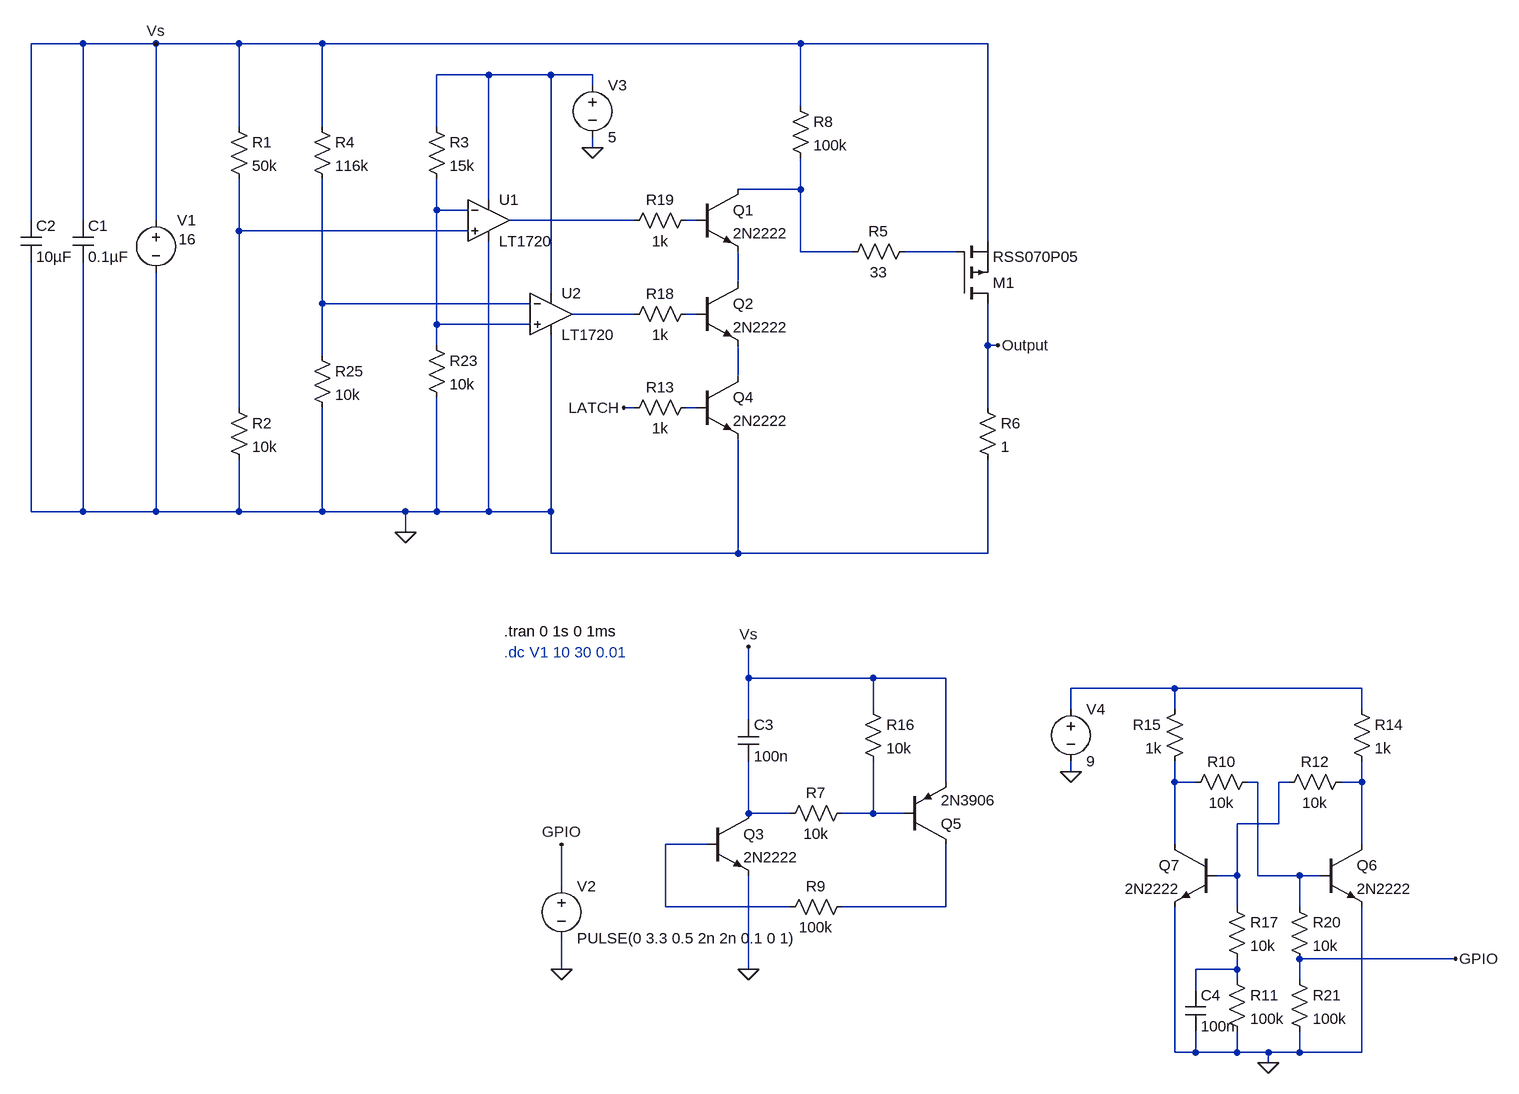
[diagram p0: schematic BatteryProtectionTest.asc]
BatteryProtectionTest.asc, the LTspice schematic file:
Version 4
SHEET 1 2308 1348
WIRE -560 -304 -640 -304
WIRE -448 -304 -560 -304
WIRE -320 -304 -448 -304
WIRE -192 -304 -320 -304
WIRE 544 -304 -192 -304
WIRE 832 -304 544 -304
WIRE 64 -256 -16 -256
WIRE 160 -256 64 -256
WIRE 224 -256 160 -256
WIRE 224 -240 224 -256
WIRE 544 -208 544 -304
WIRE -320 -176 -320 -304
WIRE -192 -176 -192 -304
WIRE -16 -176 -16 -256
WIRE 224 -144 224 -160
WIRE 544 -80 544 -128
WIRE 544 -80 448 -80
WIRE 64 -64 64 -256
WIRE -16 -48 -16 -96
WIRE 32 -48 -16 -48
WIRE -640 -32 -640 -304
WIRE -560 -32 -560 -304
WIRE -448 -32 -448 -304
WIRE 288 -32 96 -32
WIRE 384 -32 368 -32
WIRE -320 -16 -320 -96
WIRE 32 -16 -320 -16
WIRE 832 0 832 -304
WIRE 544 16 544 -80
WIRE 624 16 544 16
WIRE 784 16 704 16
WIRE 448 64 448 16
WIRE 160 80 160 -256
WIRE -192 96 -192 -96
WIRE 128 96 -192 96
WIRE 288 112 192 112
WIRE 384 112 368 112
WIRE -16 128 -16 -48
WIRE 128 128 -16 128
WIRE -16 160 -16 128
WIRE 832 160 832 96
WIRE 848 160 832 160
WIRE -192 176 -192 96
WIRE 448 208 448 160
WIRE -320 256 -320 -16
WIRE 288 256 272 256
WIRE 384 256 368 256
WIRE 832 256 832 160
WIRE -640 416 -640 32
WIRE -560 416 -560 32
WIRE -560 416 -640 416
WIRE -448 416 -448 48
WIRE -448 416 -560 416
WIRE -320 416 -320 336
WIRE -320 416 -448 416
WIRE -192 416 -192 256
WIRE -192 416 -320 416
WIRE -64 416 -192 416
WIRE -16 416 -16 240
WIRE -16 416 -64 416
WIRE 64 416 64 0
WIRE 64 416 -16 416
WIRE 160 416 160 144
WIRE 160 416 64 416
WIRE -64 448 -64 416
WIRE 160 480 160 416
WIRE 448 480 448 304
WIRE 448 480 160 480
WIRE 832 480 832 336
WIRE 832 480 448 480
WIRE 464 672 464 624
WIRE 656 672 464 672
WIRE 768 672 656 672
WIRE 1120 688 960 688
WIRE 1408 688 1120 688
WIRE 656 720 656 672
WIRE 960 720 960 688
WIRE 1120 720 1120 688
WIRE 1408 720 1408 688
WIRE 464 736 464 672
WIRE 960 816 960 800
WIRE 768 832 768 672
WIRE 1120 832 1120 800
WIRE 1152 832 1120 832
WIRE 1248 832 1232 832
WIRE 1296 832 1280 832
WIRE 1408 832 1408 800
WIRE 1408 832 1376 832
WIRE 464 880 464 800
WIRE 528 880 464 880
WIRE 656 880 656 800
WIRE 656 880 608 880
WIRE 704 880 656 880
WIRE 1280 896 1280 832
WIRE 1280 896 1216 896
WIRE 400 928 336 928
WIRE 1120 928 1120 832
WIRE 1408 928 1408 832
WIRE 1216 976 1216 896
WIRE 1216 976 1184 976
WIRE 1248 976 1248 832
WIRE 1312 976 1248 976
WIRE 1344 976 1312 976
WIRE 176 992 176 928
WIRE 336 1024 336 928
WIRE 528 1024 336 1024
WIRE 768 1024 768 928
WIRE 768 1024 608 1024
WIRE 1216 1024 1216 976
WIRE 1312 1024 1312 976
WIRE 1552 1104 1312 1104
WIRE 176 1120 176 1072
WIRE 464 1120 464 976
WIRE 1216 1120 1216 1104
WIRE 1216 1120 1152 1120
WIRE 1216 1136 1216 1120
WIRE 1312 1136 1312 1104
WIRE 1152 1152 1152 1120
WIRE 1120 1248 1120 1024
WIRE 1152 1248 1152 1216
WIRE 1152 1248 1120 1248
WIRE 1216 1248 1216 1216
WIRE 1216 1248 1152 1248
WIRE 1264 1248 1216 1248
WIRE 1312 1248 1312 1216
WIRE 1312 1248 1264 1248
WIRE 1408 1248 1408 1024
WIRE 1408 1248 1312 1248
WIRE 1264 1264 1264 1248
FLAG -64 448 0
FLAG 848 160 Output
FLAG -448 -304 Vs
FLAG 176 1120 0
FLAG 464 624 Vs
FLAG 464 1120 0
FLAG 224 -144 0
FLAG 1264 1264 0
FLAG 1552 1104 GPIO
FLAG 176 928 GPIO
FLAG 272 256 LATCH
FLAG 960 816 0
SYMBOL voltage -448 -48 R0
WINDOW 3 35 45 Left 2
WINDOW 123 0 0 Left 0
WINDOW 39 0 0 Left 0
WINDOW 0 33 16 Left 2
SYMATTR Value 16
SYMATTR InstName V1
SYMBOL Comparators\\LT1720 64 -96 R0
SYMATTR InstName U1
SYMBOL Comparators\\LT1720 160 48 R0
SYMATTR InstName U2
SYMBOL res -336 -192 R0
SYMATTR InstName R1
SYMATTR Value 50k
SYMBOL res -336 240 R0
SYMATTR InstName R2
SYMATTR Value 10k
SYMBOL res -32 -192 R0
SYMATTR InstName R3
SYMATTR Value 15k
SYMBOL res 816 240 R0
SYMATTR InstName R6
SYMATTR Value 1
SYMBOL npn 384 -80 R0
SYMATTR InstName Q1
SYMATTR Value 2N2222
SYMBOL npn 384 64 R0
SYMATTR InstName Q2
SYMATTR Value 2N2222
SYMBOL res 528 -224 R0
SYMATTR InstName R8
SYMATTR Value 100k
SYMBOL pmos 784 96 M180
SYMATTR InstName M1
SYMATTR Value RSS070P05
SYMBOL voltage 176 976 R0
WINDOW 123 0 0 Left 0
WINDOW 39 0 0 Left 0
SYMATTR InstName V2
SYMATTR Value PULSE(0 3.3 0.5 2n 2n 0.1 0 1)
SYMBOL npn 400 880 R0
SYMATTR InstName Q3
SYMATTR Value 2N2222
SYMBOL npn 384 208 R0
SYMATTR InstName Q4
SYMATTR Value 2N2222
SYMBOL res 272 272 R270
WINDOW 0 32 56 VTop 2
WINDOW 3 0 56 VBottom 2
SYMATTR InstName R13
SYMATTR Value 1k
SYMBOL cap -576 -32 R0
SYMATTR InstName C1
SYMATTR Value 0.1µF
SYMBOL cap -656 -32 R0
SYMATTR InstName C2
SYMATTR Value 10µF
SYMBOL res -32 144 R0
SYMATTR InstName R23
SYMATTR Value 10k
SYMBOL voltage 224 -256 R0
SYMATTR InstName V3
SYMATTR Value 5
SYMBOL res -208 -192 R0
SYMATTR InstName R4
SYMATTR Value 116k
SYMBOL res -208 160 R0
SYMATTR InstName R25
SYMATTR Value 10k
SYMBOL res 720 0 R90
WINDOW 0 0 56 VBottom 2
WINDOW 3 32 56 VTop 2
SYMATTR InstName R5
SYMATTR Value 33
SYMBOL pnp 704 928 M180
SYMATTR InstName Q5
SYMATTR Value 2N3906
SYMBOL res 624 864 R90
WINDOW 0 0 56 VBottom 2
WINDOW 3 32 56 VTop 2
SYMATTR InstName R7
SYMATTR Value 10k
SYMBOL res 624 1008 R90
WINDOW 0 0 56 VBottom 2
WINDOW 3 32 56 VTop 2
SYMATTR InstName R9
SYMATTR Value 100k
SYMBOL npn 1344 928 R0
SYMATTR InstName Q6
SYMATTR Value 2N2222
SYMBOL npn 1184 928 M0
SYMATTR InstName Q7
SYMATTR Value 2N2222
SYMBOL res 1248 816 R90
WINDOW 0 0 56 VBottom 2
WINDOW 3 32 56 VTop 2
SYMATTR InstName R10
SYMATTR Value 10k
SYMBOL res 1392 816 R90
WINDOW 0 0 56 VBottom 2
WINDOW 3 32 56 VTop 2
SYMATTR InstName R12
SYMATTR Value 10k
SYMBOL res 1392 704 R0
SYMATTR InstName R14
SYMATTR Value 1k
SYMBOL res 1136 704 M0
SYMATTR InstName R15
SYMATTR Value 1k
SYMBOL res 272 128 R270
WINDOW 0 32 56 VTop 2
WINDOW 3 0 56 VBottom 2
SYMATTR InstName R18
SYMATTR Value 1k
SYMBOL res 272 -16 R270
WINDOW 0 32 56 VTop 2
WINDOW 3 0 56 VBottom 2
SYMATTR InstName R19
SYMATTR Value 1k
SYMBOL voltage 960 704 R0
SYMATTR InstName V4
SYMATTR Value 9
SYMBOL res 640 704 R0
SYMATTR InstName R16
SYMATTR Value 10k
SYMBOL cap 448 736 R0
SYMATTR InstName C3
SYMATTR Value 100n
SYMBOL res 1200 1120 R0
SYMATTR InstName R11
SYMATTR Value 100k
SYMBOL res 1200 1008 R0
SYMATTR InstName R17
SYMATTR Value 10k
SYMBOL res 1296 1008 R0
SYMATTR InstName R20
SYMATTR Value 10k
SYMBOL res 1296 1120 R0
SYMATTR InstName R21
SYMATTR Value 100k
SYMBOL cap 1136 1152 R0
SYMATTR InstName C4
SYMATTR Value 100n
TEXT 88 600 Left 2 !.tran 0 1s 0 1ms
TEXT 88 632 Left 2 ;.dc V1 10 30 0.01

The netlist it stands for:
* BatteryProtectionTest.asc
V1 Vs 0 16
XU1 N006 N003 N001 0 N004 LT1720  ; pins In+ In- V+ V- OUT
XU2 N003 N009 N001 0 N010 LT1720  ; pins In+ In- V+ V- OUT
R1 Vs N006 50k
R2 N006 0 10k
R3 N001 N003 15k
R6 Output 0 1
Q1 N002 N005 N008 0 2N2222
Q2 N008 N011 N012 0 2N2222
R8 Vs N002 100k
M1 Output N007 Vs Vs RSS070P05
V2 GPIO 0 PULSE(0 3.3 0.5 2n 2n 0.1 0 1)
Q3 N019 N021 0 0 2N2222
Q4 N012 N013 0 0 2N2222
R13 LATCH N013 1k
C1 Vs 0 0.1µF
C2 Vs 0 10µF
R23 N003 0 10k
V3 N001 0 5
R4 Vs N009 116k
R25 N009 0 10k
R5 N007 N002 33
Q5 N022 N020 Vs 0 2N3906
R7 N020 N019 10k
R9 N022 N021 100k
Q6 N018 N016 0 0 2N2222
Q7 N015 N017 0 0 2N2222
R10 N016 N015 10k
R12 N018 N017 10k
R14 N014 N018 1k
R15 N014 N015 1k
R18 N010 N011 1k
R19 N004 N005 1k
V4 N014 0 9
R16 Vs N020 10k
C3 Vs N019 100n
R11 N023 0 100k
R17 N017 N023 10k
R20 N016 GPIO 10k
R21 GPIO 0 100k
C4 N023 0 100n
.model NPN NPN
.model PNP PNP
.lib standard.bjt
.model NMOS NMOS
.model PMOS PMOS
.lib standard.mos
.tran 0 1s 0 1ms
* .dc V1 10 30 0.01
.lib LT1720.sub
.backanno
.end